# Altium schematic sheet LPGDetA1_supply.SchDoc
size A4; DocumentNumber: 4; SheetNumber: 4; SheetTotal: 6; Subtitle0: Zasilanie; LotOfPieces: 1; SVNPath: SVNPath
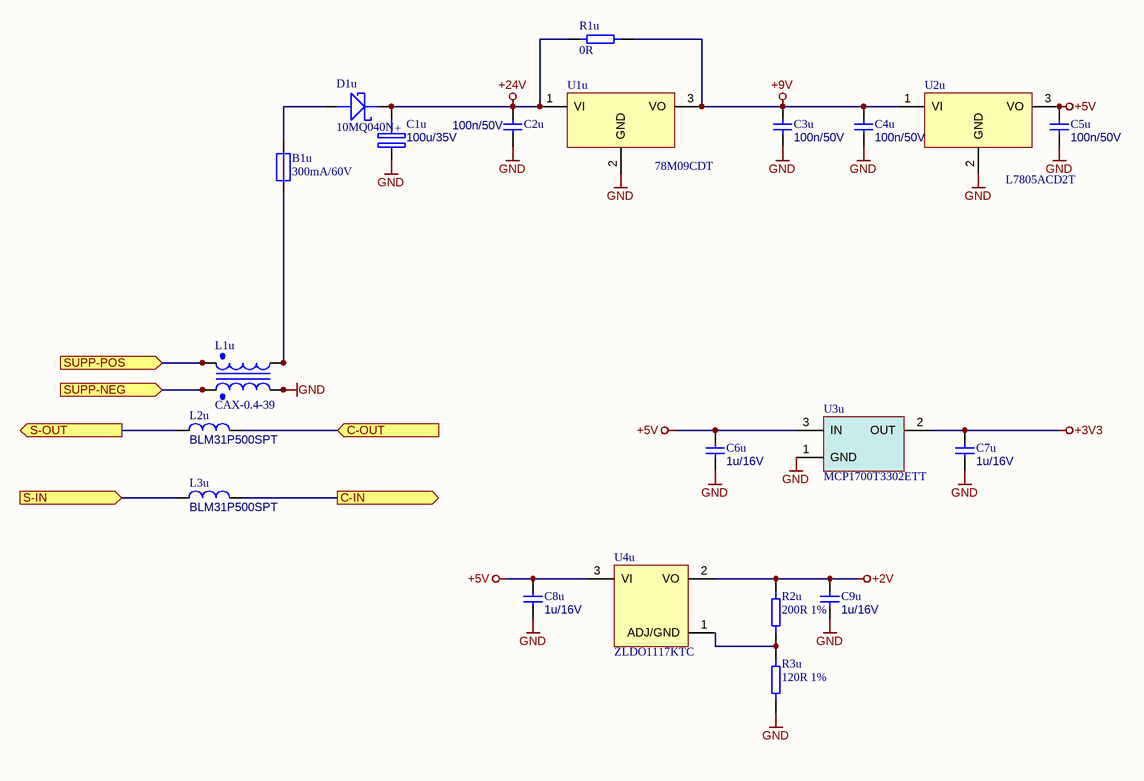
[diagram p0: LPGDetA1_supply.SchDoc]

## Parts
?  (no value)
B1u  OtherParams: 300mA/60V  [2920]  (hidden comment: SL030-60)
C1u  OtherParams: 100u/35V  [CE1028]  (hidden comment: SD1V107M6L011BB)
C2u  OtherParams: 100n/50V  [1206_0805]  (hidden comment: CL21B104KBCNNNC)
C3u  OtherParams: 100n/50V  [1206_0805]  (hidden comment: CL21B104KBCNNNC)
C4u  OtherParams: 100n/50V  [1206_0805]  (hidden comment: CL21B104KBCNNNC)
C5u  OtherParams: 100n/50V  [1206_0805]  (hidden comment: CL21B104KBCNNNC)
C6u  OtherParams: 1u/16V  [1206_0805]  (hidden comment: C0805C105K4RAC)
C7u  OtherParams: 1u/16V  [1206_0805]  (hidden comment: C0805C105K4RAC)
C8u  OtherParams: 1u/16V  [0805]  (hidden comment: C0805C105K4RAC)
C9u  OtherParams: 1u/16V  [1206_0805]  (hidden comment: C0805C105K4RAC)
D1u  10MQ040N  [SMA]
L1u  CAX-0.4-39  [IND_CAX_V]
L2u  BLM31P500SPT  [1206]
L3u  BLM31P500SPT  [1206]
R1u  OtherParams: 0R  [1206_0805]  (hidden comment: 0805WAJ 0R T5E)
R2u  OtherParams: 200R 1%  [0805]  (hidden comment: 0805WAF 200R T5E)
R3u  OtherParams: 120R 1%  [1206_0805]  (hidden comment: 0805WAF 120R T5E)
U1u  78M09CDT  [TO-252]
U2u  L7805ACD2T  [D2PAK]
U3u  MCP1700T3302ETT  [SOT23-3]
U4u  ZLDO1117KTC  [TO-252]

## Ports
C-IN, C-OUT, S-IN, S-OUT, SUPP-NEG, SUPP-POS

## Nets
+2V: C9u.1 R2u.1 U4u.2(VO)
+3V3: C7u.1 U3u.2(OUT)
+5V: C5u.1 C6u.1 C8u.1 U2u.3(VO) U3u.3(IN) U4u.3(VI)
+9V: C3u.1 C4u.1 R1u.2 U1u.3(VO) U2u.1(VI)
+24V: C1u.2 C2u.1 D1u.CATH R1u.1 U1u.1(VI)
GND: C1u.1 C2u.2 C3u.2 C4u.2 C5u.2 C6u.2 C7u.2 C8u.2 C9u.2 L1u.5(OUT2) L1u.6(OUT2) R3u.2 U1u.2(GND) U2u.2(GND) U3u.1(GND)
C-IN: L3u.2 ; port C-IN
C-OUT: L2u.2 ; port C-OUT
S-IN: L3u.1 ; port S-IN
S-OUT: L2u.1 ; port S-OUT
SUPP-NEG: L1u.3(IN2) L1u.4(IN2) ; port SUPP-NEG
SUPP-POS: L1u.1(IN1) L1u.2(IN1) ; port SUPP-POS
NetB1u_1: B1u.1 D1u.ANOD
NetB1u_2: B1u.2 L1u.7(OUT1) L1u.8(OUT1)
NetR2u_2: R2u.2 R3u.1 U4u.1(ADJ/GND)

## Notes on the sheet
- K.A.
- echnology
- Wariant:
- Projekt i wykonanie: Miroslaw Lach MRQ, www.mrq-ml.com
- "AMPROJECT" Andrzej Maciejak
- SVNPath:
- Page:
- Rev.
- /
- File name:
- (in symbol SD1V107M6L011BB[[/\]]CE1028[[/\]]35V[[/\]]20%[[/\]]100u/35V) +

## Library data of the parts
? = KATECHNOLOGYLOGO
B1u = 300mA/60V[[/\]]SL030-60[[/\]]2920: Descript: SMD polymer fuse 300mA, 60VDC; Typ5: SL030; Amount5: 10+; Currency5: PLN; Value: SL030-60; Dimensions: 2920; ComponentLink1Description: Datasheet; ComponentLink1URL: http://www.mrq-ml.com/Parts/Electromechanical/K1008322279.pdf; Supplier5: tme.pl; Reference5: SL030-60; Manufacturer5: ECE; DateOfPrice5: 2012-11-24; Price1: 0,51; Price5: 0,58
C1u = SD1V107M6L011BB[[/\]]CE1028[[/\]]35V[[/\]]20%[[/\]]100u/35V: MaxVoltage: 35V; Tolerance: 20%; Descript: capacitor 100uF, 35V, low impedance, fi 6.3mmx11mm; Currency5: PLN; Amount5: 25+; Value: SD1V107M6L011BB; Dimensions: CE1028; ComponentLink1Description: Datasheet; ComponentLink1URL: http://www.mrq-ml.com/Parts/Capacitors/Samwha-sd.pdf; Supplier5: tme.pl; Reference5: SD1V107M6L011BB; Manufacturer5: SAMHA; Typ5: SD1V107M6L011BB; Price5: 0,2; DateOfPrice5: 2012-11-24; Price1: 0,15
C2u C3u C4u C5u = CL21B104KBCNNNC[[/\]]0805[[/\]]50V[[/\]]10%[[/\]]100n/50V: MaxVoltage: 50V; Tolerance: 10%; Descript: capacitor 100nF/50V, 0805, X7R, 10%; Currency5: PLN; Amount5: 100+; Value: CL21B104KBCNNNC; Dimensions: 0805; ComponentLink1Description: Datasheet; ComponentLink1URL: http://www.mrq-ml.com/Parts/Capacitors/mlcc_samsung.pdf; Supplier5: tme.pl; Reference5: CL21B104KBCNNNC; Manufacturer5: Samsung; Typ5: CL21B104KBCNNNC; Price5: 0,025; DateOfPrice5: 2013-01-03; Price1: 0,019
C6u C7u C8u C9u = C0805C105K4RAC[[/\]]0805[[/\]]16V[[/\]]10%[[/\]]1u/16V: MaxVoltage: 16V; Tolerance: 10%; Descript: capacitor 1uF, 16V, 0805, 10%, X7R; Currency5: PLN; Amount5: 100+; Value: C0805C105K4RAC; Dimensions: 0805; ComponentLink1Description: Datasheet; ComponentLink1URL: http://www.mrq-ml.com/Parts/Capacitors/ceramic_chip_kemet.pdf; Supplier5: tme.pl; Reference5: C0805C105K4RAC; Manufacturer5: KEMET; Typ5: C0805C105K4RAC; Price5: 0,099; DateOfPrice5: 2013-01-03; Price1: 0,099
D1u = 10MQ040N[[/\]]SMA: Descript: Diode type:Schottky; Voltage, Vrrm:40V; Current, If av:1.5A; Voltage, Vf max:0.62V; Case style:SMA; Typ5: 10MQ040NTRPBF; Currency5: PLN; Amount5: 5+; Value: 10MQ040N; Dimensions: SMA; ComponentLink1Description: Datasheet; ComponentLink1URL: http://mrq-ml.com/Parts/Diodes/10mq040n.pdf; Supplier5: tme.pl; Reference5: 10MQ040N; Manufacturer5: Vishay; Price5: 0,5; DateOfPrice5: 2012-11-24; Price1: 0,425
L1u = CAX-0.4-39[[/\]]17.8x12.8x20[[/\]]CAX-0.4-39: Descript: Common mode choke 2x39muH, 0.4A; Amount5: 1+; Currency5: PLN; Value: CAX-0.4-39; OtherParams: CAX-0.4-39; Dimensions: 17.8x12.8x20; ComponentLink1Description: Datasheet; ComponentLink1URL: http://www.mrq-ml.com/Parts/Inductors/Talema_ca_series_.pdf; Supplier5: tme.pl; Reference5: CAX-0.4-39; Manufacturer5: Talema; Typ5: CAX-0.4-39; DateOfPrice5: 2012-12-18; Price5: 4,49; Price1: 3,4900
L2u L3u = BLM31P500SPT[[/\]]1206[[/\]]BLM31P500SPT: Descript: Ferrite bead SMD, 1206, 3A, 0,025ohm; Typ5: BLM31PG500SN1L; Currency5: PLN; Amount5: 100+; Value: BLM31P500SPT; OtherParams: BLM31P500SPT; Dimensions: 1206; ComponentLink1Description: Datasheet; ComponentLink1URL: http://www.mrq-ml.com/Parts/Inductors/Murata_EMI_Suppression_Filters_DC.pdf; Supplier5: tme.pl; Reference5: BLM31P500SPT; Manufacturer5: Murata; Price5: 0,449; DateOfPrice5: 2012-07-17
R1u = 0805WAJ 0R T5E[[/\]]0805[[/\]]0.125W[[/\]]0.1R[[/\]]0R: DissPower: 0.125W; Tolerance: 0.1R; Descript: Resistor 0 ohm, SMD, 0805; Reference5: SMD0805-0R; Currency5: PLN; Amount5: 100+; Value: 0805WAJ 0R T5E; Dimensions: 0805; ComponentLink1Description: Datasheet; ComponentLink1URL: http://www.mrq-ml.com/Parts/Resistors/RoyalOhm_rezystor-smd.pdf; Supplier5: tme.pl; Manufacturer5: Royal Ohm; Typ5: 0805WAJ 0R T5E; Price5: 0,025; DateOfPrice5: 2012-11-24; Price1: 0,025
R2u = 0805WAF 200R T5E[[/\]]0805[[/\]]0.125W[[/\]]1%[[/\]]200R 1%: DissPower: 0.125W; Tolerance: 1%; Descript: Resistor 200ohm, 1%, 0805; Reference5: SMD0805-200R-1%; Currency5: PLN; Amount5: 100+; Value: 0805WAF 200R T5E; Dimensions: 0805; ComponentLink1Description: Datasheet; ComponentLink1URL: http://www.mrq-ml.com/Parts/Resistors/RoyalOhm_rezystor-smd.pdf; Supplier5: tme.pl; Manufacturer5: Royal Ohm; Typ5: 0805WAF 200R T5E; Price5: 0,029; DateOfPrice5: 2012-09-19; Price1: 0,018
R3u = 0805WAF 120R T5E[[/\]]0805[[/\]]0.125W[[/\]]1%[[/\]]120R 1%: DissPower: 0.125W; Tolerance: 1%; Descript: Resistor 120ohm, 0805, 1%; Reference5: SMD0805-120R-1%; Currency5: PLN; Amount5: 100+; Value: 0805WAF 120R T5E; Dimensions: 0805; ComponentLink1Description: Datasheet; ComponentLink1URL: http://www.mrq-ml.com/Parts/Resistors/RoyalOhm_rezystor-smd.pdf; Supplier5: tme.pl; Manufacturer5: Royal Ohm; Typ5: 0805WAF 120R T5E; Price5: 0,029; DateOfPrice5: 2012-11-24; Price1: 0,029
U1u = 78M09CDT[[/\]]TO-252: Descript: +9V voltage regulator TO-252, 0.5A; Currency5: PLN; Amount5: 5+; Value: 78M09CDT; Price1: 0,743; Dimensions: TO-252; ComponentLink1Description: Datasheet; ComponentLink1URL: http://www.mrq-ml.com/Parts/ICs/l78m12c.pdf; Supplier5: tme.pl; Reference5: 78M09CDT; Price5: 0,935; DateOfPrice5: 2012-11-24
U2u = L7805ACD2T[[/\]]D2PAK: Descript: Precision voltage regulator 5V/1A D2PAK; Currency5: PLN; Amount5: 3+; Value: L7805ACD2T; Dimensions: D2PAK; ComponentLink1Description: Datasheet; ComponentLink1URL: http://www.mrq-ml.com/Parts/ICs/l7805ac.pdf; Supplier5: tme.pl; Reference5: L7805ACD2T; Manufacturer5: ST; Typ5: L7805ACD2T; Price5: 1,37; DateOfPrice5: 2012-11-24; Price1: 1,09
U3u = MCP1700T3302ETT[[/\]]SOT23-3: Descript: Low quiescent current LDO, 3.3V, 250mA, SOT-23; Typ5: MCP1700T3302E/TT; Currency5: PLN; Amount5: 3+; Value: MCP1700T3302ETT; Price1: 1,2; Dimensions: SOT23-3; ComponentLink1Description: Datasheet; ComponentLink1URL: http://www.mrq-ml.com/Parts/ICs/MCP1700.pdf; Supplier5: tme.pl; Reference5: MCP1700T3302ETT; Manufacturer5: Microchip; Price5: 1,3; DateOfPrice5: 2012-09-20
U4u = ZLDO1117KTC[[/\]]TO-252: Descript: 1A 1.25 to 17V adjustable low drop positive voltage regulator; Reference5: 1825384; Currency5: PLN; Amount5: 1+; Value: ZLDO1117KTC; Price1: 1,91; Dimensions: TO-252; ComponentLink1Description: Datasheet; ComponentLink1URL: http://www.mrq-ml.com/Parts/ICs/ZLDO1117.pdf; Supplier5: farnell.com; Manufacturer5: Diodes Inc.; Typ5: ZLDO1117KTC; Price5: 2,39; DateOfPrice5: 2012-09-19